# Altium project GPSGSMTruck.PrjPcb
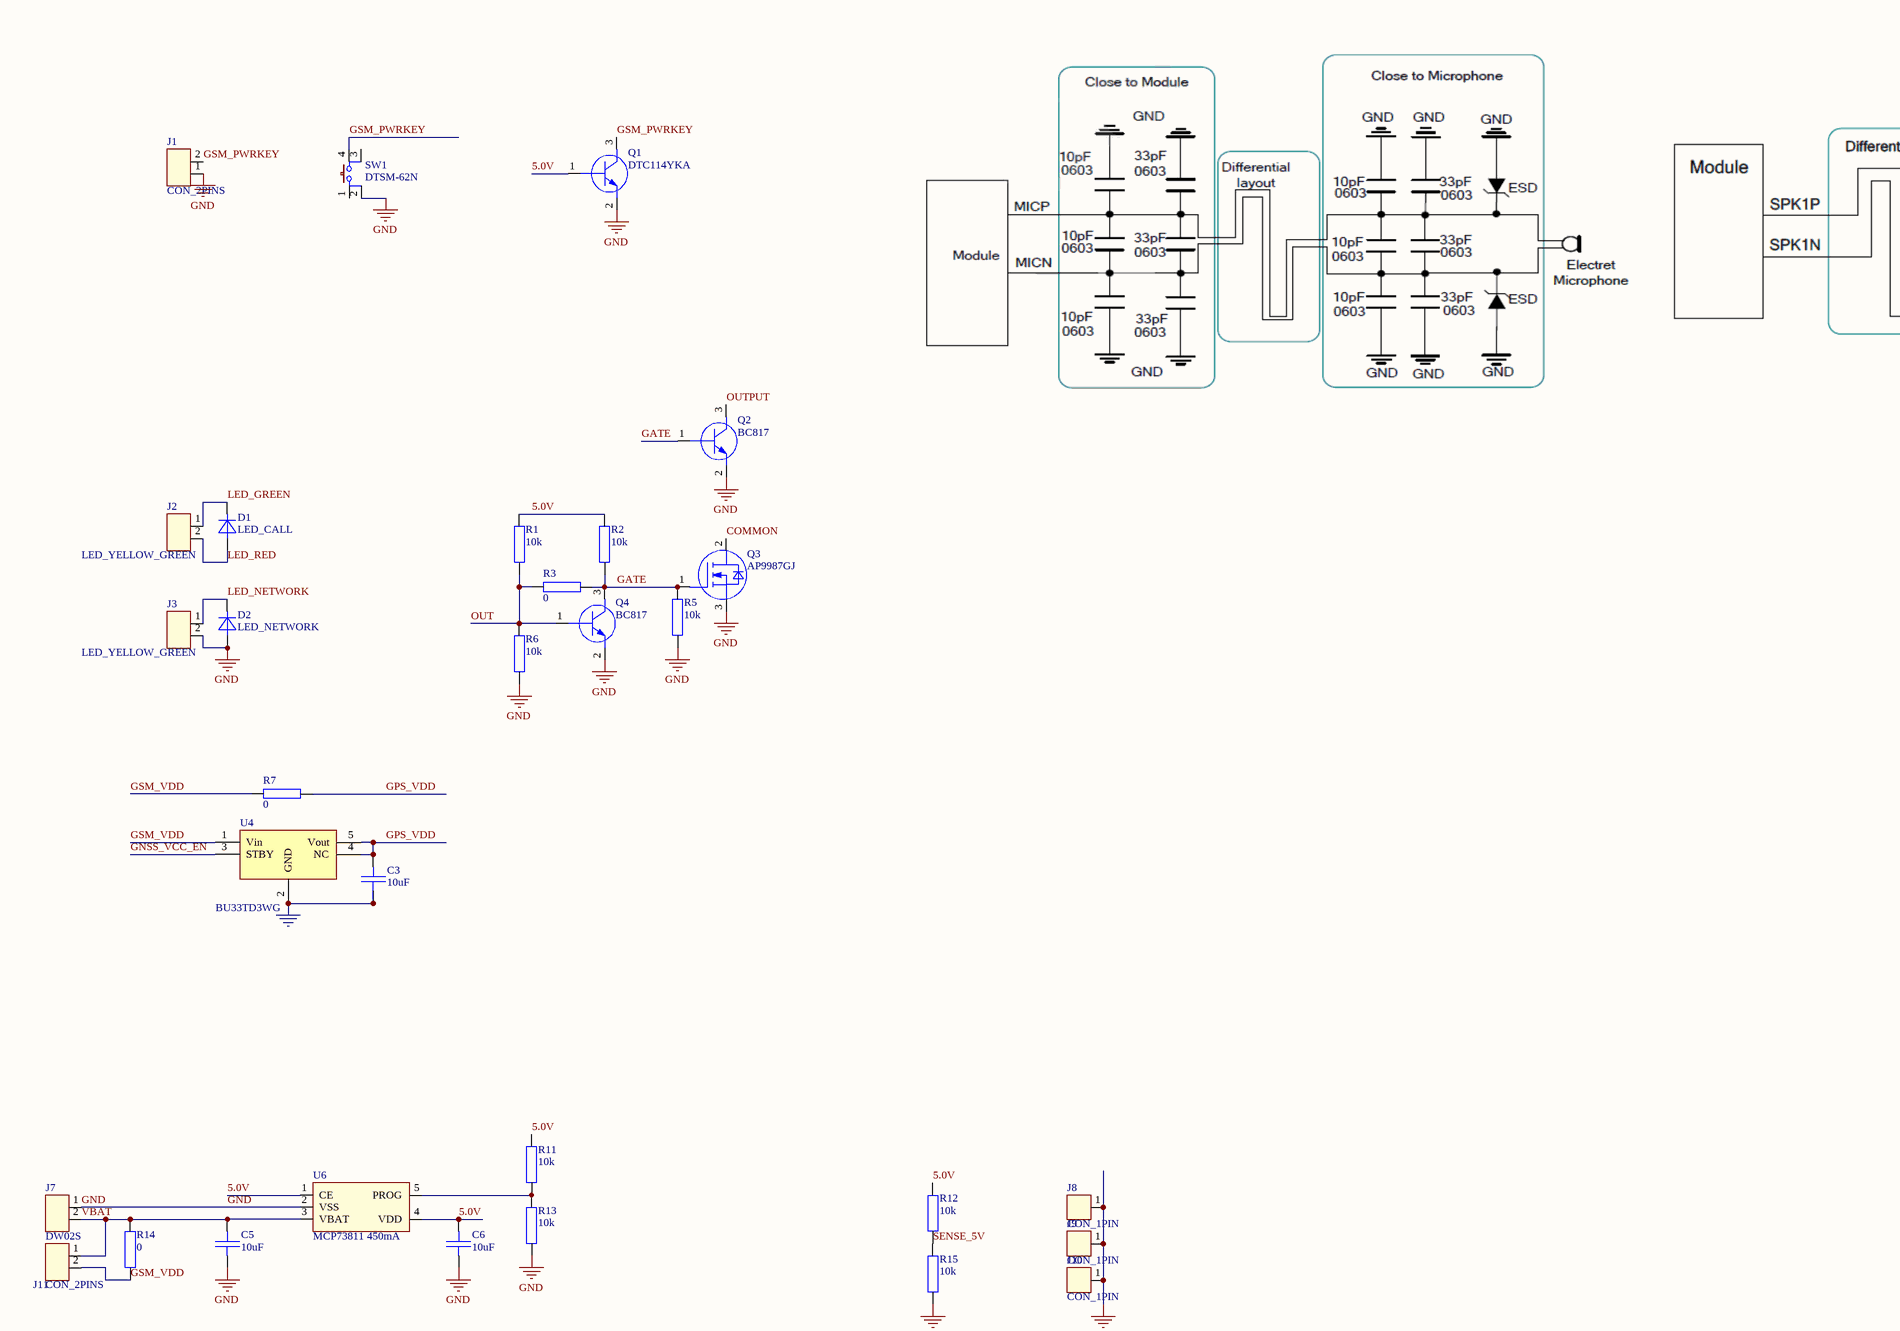
[diagram p0: GPSGSMTruck.SchDoc, top left]
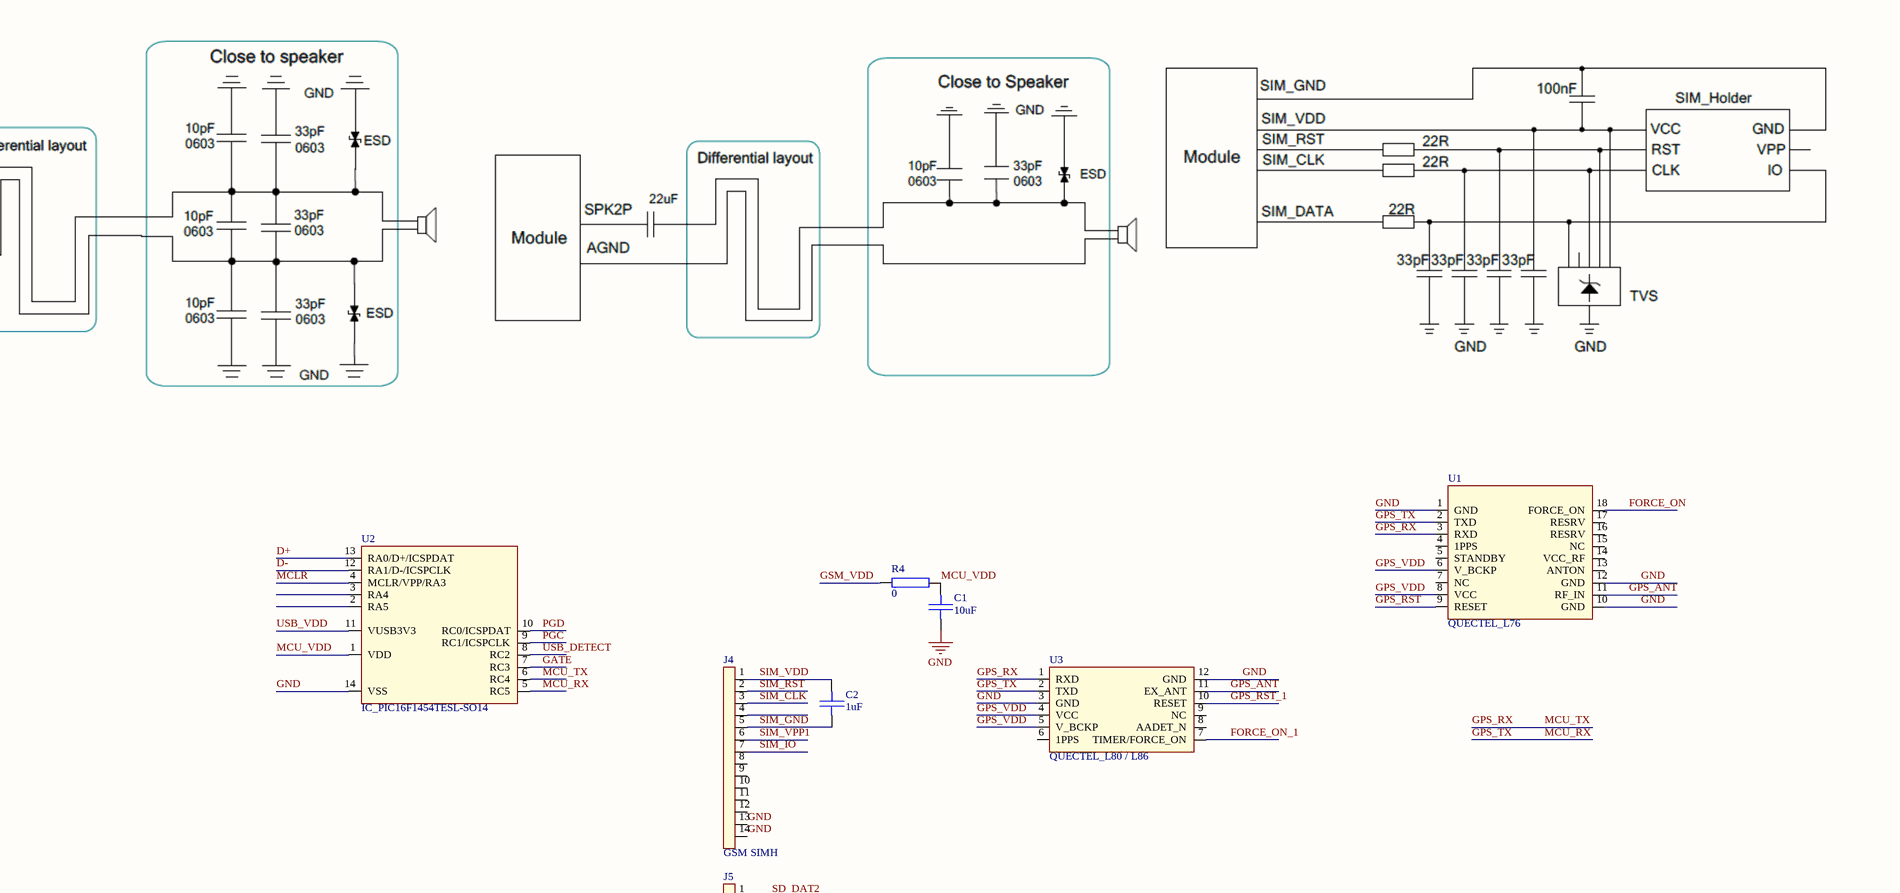
[diagram p1: GPSGSMTruck.SchDoc, top right]
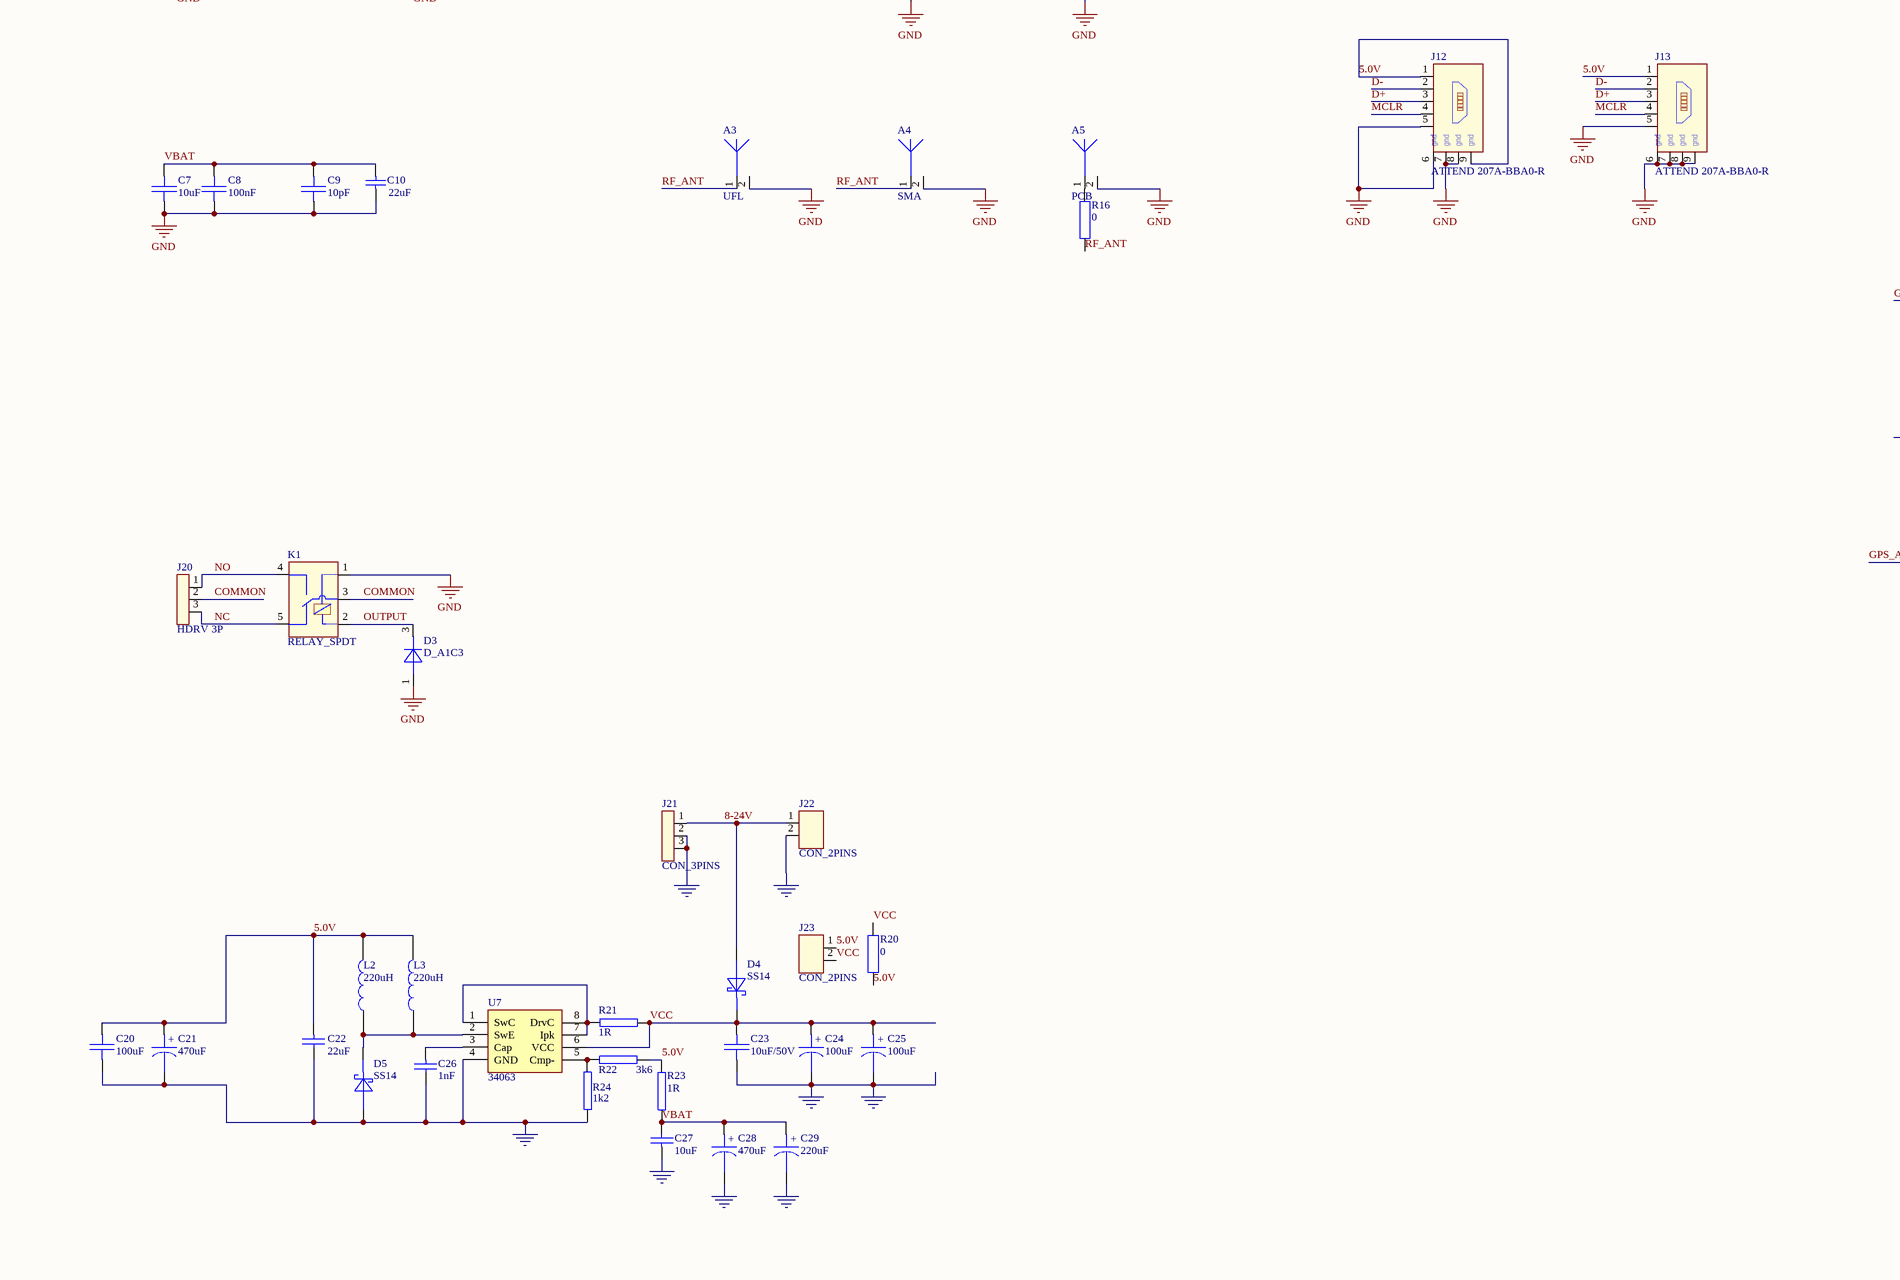
[diagram p2: GPSGSMTruck.SchDoc, bottom left]
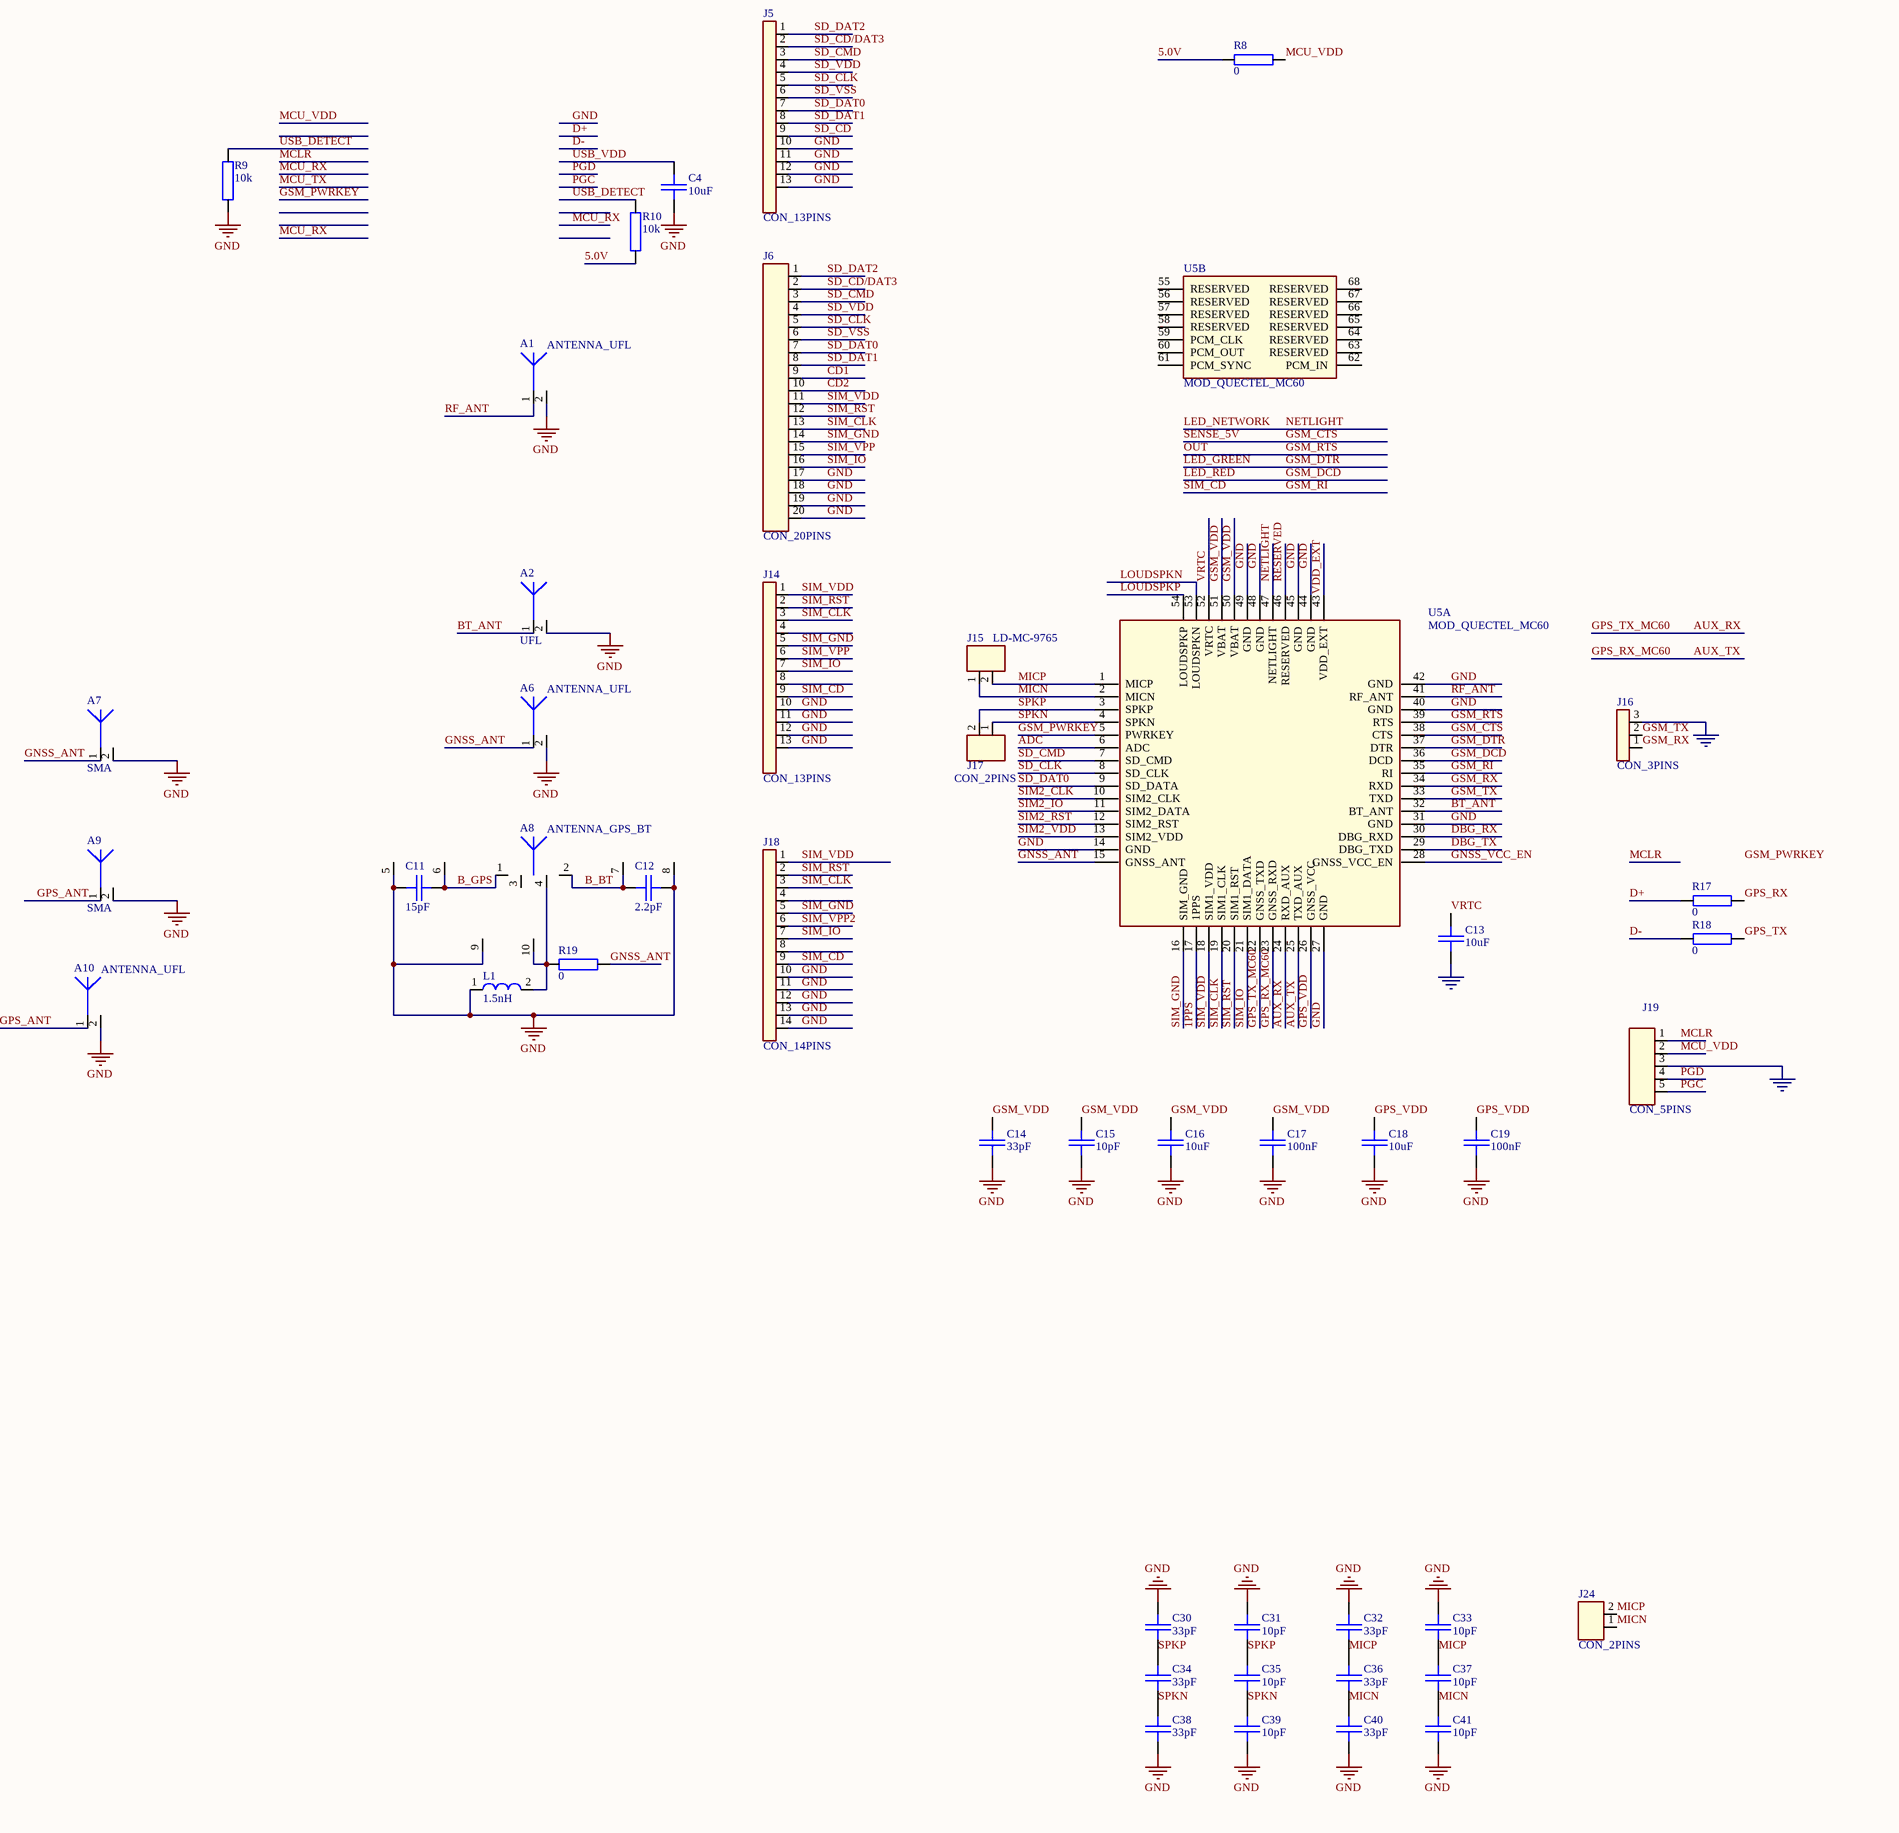
[diagram p3: GPSGSMTruck.SchDoc, bottom right]
1 sheet, 120 parts. Net scope: global (net labels, ports and power ports of the same name join across sheets).
Board file: GPSGSMTruck.PcbDoc

## Sheet GPSGSMTruck.SchDoc
size A1

### Parts
A1  ANTENNA_UFL  [SMD_CON_ANTENNA_UFL]
A2  UFL  [SMD_CON_ANTENNA_UFL]
A3  UFL  [SMD_CON_ANTENNA_UFL]
A4  SMA  [SMD_CON_ANTENNA_SMA_RIGHT_ANGLE]
A5  PCB  [SMD_CON_ANTENNA_GSM_PCB_1_INV]
A6  ANTENNA_UFL  [SMD_CON_ANTENNA_UFL]
A7  SMA  [SMD_CON_ANTENNA_SMA_RIGHT_ANGLE]
A8  ANTENNA_GPS_BT  [SMD_CHIP_ANTENNA_GPS_BT]
A9  SMA  [SMD_CON_ANTENNA_SMA_RIGHT_ANGLE]
A10  ANTENNA_UFL  [SMD_CON_ANTENNA_UFL]
C1  10uF  [SMD_0402_CAPC1005X90N]
C2  1uF  [SMD_0603_CAPC1608X95N]
C3  10uF  [SMD_0402_CAPC1005X90N]
C4  10uF  [SMD_0402_CAPC1005X90N]
C5  10uF  [SMD_0603_CAPC1608X95N]
C6  10uF  [SMD_0603_CAPC1608X95N]
C7  10uF  [SMD_0805_CAPC2012X95N]
C8  100nF  [SMD_0603_CAPC1608X95N]
C9  10pF  [SMD_0603_CAPC1608X95N]
C10  22uF  [SMD_1210_CAPC3225X279N]
C11  15pF  [SMD_0402_CAPC1005X90N - ANTENNA]
C12  2.2pF  [SMD_0201_CAPC0603X33N - ANTENNA]
C13  10uF  [SMD_0402_CAPC1005X90N]
C14  33pF  [SMD_0402_CAPC1005X90N]
C15  10pF  [SMD_0402_CAPC1005X90N]
C16  10uF  [SMD_0402_CAPC1005X90N]
C17  100nF  [SMD_0402_CAPC1005X90N]
C18  10uF  [SMD_0402_CAPC1005X90N]
C19  100nF  [SMD_0402_CAPC1005X90N]
C20  100uF  [SMD_1210_CAPC3225X279N]
C21  470uF  [PTH_CAPPR250-800X800]
C22  22uF  [SMD_0805_CAPC2012X145N]
C23  10uF/50V  [SMD_1210_CAPC3225X279N]
C24  100uF  [SMD_CAPAE660X550N]
C25  100uF  [PTH_CAPPR250-800X800]
C26  1nF  [SMD_0603_CAPC1608X95N]
C27  10uF  [SMD_0603_CAPC1608X95N]
C28  470uF  [PTH_CAPPR250-800X800]
C29  220uF  [SMD_CAPAE660X550N]
C30  33pF  [SMD_0603_CAPC1608X95N]
C31  10pF  [SMD_0603_CAPC1608X95N]
C32  33pF  [SMD_0603_CAPC1608X95N]
C33  10pF  [SMD_0603_CAPC1608X95N]
C34  33pF  [SMD_0603_CAPC1608X95N]
C35  10pF  [SMD_0603_CAPC1608X95N]
C36  33pF  [SMD_0603_CAPC1608X95N]
C37  10pF  [SMD_0603_CAPC1608X95N]
C38  33pF  [SMD_0603_CAPC1608X95N]
C39  10pF  [SMD_0603_CAPC1608X95N]
C40  33pF  [SMD_0603_CAPC1608X95N]
C41  10pF  [SMD_0603_CAPC1608X95N]
D1  LED_CALL  [SMD_0805_LED2012X100N]
D2  LED_NETWORK  [SMD_0805_LED2012X100N]
D3  D_A1C3  [SMD_SOT23_SOT95P240X120-3N]
D4  SS14  [SMD_DO214AC_SMA]
D5  SS14  [SMD_DO214AC_SMA]
J1  CON_2PINS  [PTH_HDRV02W64P254_1X02]
J2  LED_YELLOW_GREEN  [PTH_LED-KINGBRIGHT-L-934SGC]
J3  LED_YELLOW_GREEN  [PTH_LED-KINGBRIGHT-L-934SGC]
J4  GSM SIMH  [SMD_CON-ATTEND_SIM_115B-AAA0-R01]
J5  CON_13PINS  [NONE]
J6  CON_20PINS  [NONE]
J7  DW02S  [PTH_HDRV02W64P254_1X02_BATTERY]
J8  CON_1PIN  [PTH_MOUNT_HOLE]
J9  CON_1PIN  [PTH_MOUNT_HOLE]
J10  CON_1PIN  [PTH_MOUNT_HOLE]
J11  CON_2PINS  [PTH_HDRV02W64P254_1X02]
J12  ATTEND 207A-BBA0-R  [SMD_CON_MICRO_USB]
J13  ATTEND 207A-BBA0-R  [SMD_CON-CVILUX-CU04-SCM15B0]
J14  CON_13PINS  [SMD_CON-ATTEND_MICRO_SIM_115Q-BCA0]
J15  LD-MC-9765  [PTH_MIC_9.6MM_6MM]
J16  CON_3PINS  [PTH_HDRV03W64P254_1X03]
J17  CON_2PINS  [PTH_MIC_6MM_2.7MM_PITCH1.9]
J18  CON_14PINS  [NONE]
J19  CON_5PINS  [SIP5 - PGM]
J20  HDRV 3P  [PTH_HDRV03W11060P500_1X03]
J21  CON_3PINS  [PTH_DC-POWER-JACK_210-112]
J22  CON_2PINS  [PTH_HDRV02W11060P350_1X02]
J23  CON_2PINS  [PTH_HDRV02W64P254_1X02]
J24  CON_2PINS  [PTH_MIC_6MM_2.7MM_PITCH1.9]
K1  RELAY_SPDT  [PTH_REL_RAS]
L1  1.5nH  [SMD_0402_INDC1005X55N - ANTENNA]
L2  220uH  [SMD_INDM600500]
L3  220uH  [PTH_CAPPR250-800X800]
Q1  DTC114YKA  [SMD_SOT23_SOT95P240X120-3N]
Q2  BC817  [SMD_SOT23_SOT95P240X120-3N]
Q3  AP9987GJ  [PTH_TO220AB]
Q4  BC817  [SMD_SOT23_SOT95P240X120-3N]
R1  10k  [SMD_0603_RESC1608X55N]
R2  10k  [SMD_0603_RESC1608X55N]
R3  0  [SMD_0603_RESC1608X55N]
R4  0  [SMD_0402_RESC1005X37N]
R5  10k  [SMD_0603_RESC1608X55N]
R6  10k  [SMD_0603_RESC1608X55N]
R7  0  [SMD_0402_RESC1005X37N]
R8  0  [SMD_0402_RESC1005X37N]
R9  10k  [SMD_0402_RESC1005X37N]
R10  10k  [SMD_0402_RESC1005X37N]
R11  10k  [SMD_0603_RESC1608X55N]
R12  10k  [SMD_0603_RESC1608X55N]
R13  10k  [SMD_0603_RESC1608X55N]
R14  0  [SMD_0603_RESC1608X55N]
R15  10k  [SMD_0603_RESC1608X55N]
R16  0  [SMD_0402_RESC1005X37N]
R17  0  [SMD_0402_RESC1005X37N]
R18  0  [SMD_0402_RESC1005X37N]
R19  0  [SMD_0402_RESC1005X37N]
R20  0  [SMD_0603_RESC1608X55N]
R21  1R  [SMD_0805_RESC2012X60N]
R22  3k6  [SMD_0603_RESC1608X55N]
R23  1R  [SMD_0603_RESC1608X55N]
R24  1k2  [SMD_0603_RESC1608X55N]
SW1  DTSM-62N  [SMD_SW_TACT-64K_5]
U1  QUECTEL_L76  [SMD_MOD_L76_SOIC110P970X1010-18N]
U2  IC_PIC16F1454TESL-SO14  [SMD_SOIC127P600X175-14N]
U3  QUECTEL_L80 / L86  [SMD_MOD_L80_SOIC254P1600X1600-12N]
U4  BU33TD3WG  [SMD_SOT26_SOT95P285X140-5N - DLV]
U5  MOD_QUECTEL_MC60  [SMD_MOD_MC60_54_PIN]  (parts A,B of 2)
U6  MCP73811 450mA  [SMD_SOT26_SOT95P285X140-5N - DLV]
U7  34063  [SMD_SOIC127P600X175-8N]

### Nets
GND: A1.2 A2.2 A3.2 A4.2 A5.2 A6.2 A7.2 A8.5 A8.8 A8.9 A9.2 A10.2 C1.2 C3.2 C4.2 C5.2 C6.2 C7.2 C8.2 C9.2 C10.2 C11.1 C12.2 C13.2 C14.2 C15.2 C16.2 C17.2 C18.2 C19.2 C20.1 C21.2 C22.2 C23.1 C24.2 C25.2 C26.2 C27.1 C28.2 C29.2 C30.1 C31.1 C32.1 C33.1 C38.2 C39.2 C40.2 C41.2 D2.2(A) D3.1(A) D5.2(A) J1.1 J3.2 J4.13 J4.14 J5.10 J5.11 J5.12 J5.13 J6.17 J6.18 J6.19 J6.20 J7.1 J8.1 J9.1 J10.1 J12.5 J12.6 J12.7 J12.8 J13.5 J13.6 J13.7 J13.8 J13.9 J14.10 J14.11 J14.12 J14.13 J16.3 J18.10 J18.11 J18.12 J18.13 J18.14 J19.3 J21.2 J21.3 J22.2 K1.1 L1.1 Q1.2(E) Q2.2(E) Q3.3(S) Q4.2(E) R5.2 R6.2 R9.1 R13.2 R15.2 R24.2 SW1.2 U1.1(GND) U1.10(GND) U1.12(GND) U2.14(VSS) U3.3(GND) U3.12(GND) U4.2(GND) U5.14(GND) U5.27(GND) U5.31(GND) U5.40(GND) U5.42(GND) U5.44(GND) U5.45(GND) U5.48(GND) U5.49(GND) U6.2(VSS) U7.4(GND)
1PPS: U5.17(1PPS)
5.0V: C6.1 C20.2 C21.1 C22.1 J12.1 J12.9 J13.1 J23.1 L2.2 L3.2 Q1.1(B) R1.1 R2.1 R8.1 R10.2 R11.1 R12.1 R20.2 R22.1 R23.2 U6.1(CE) U6.4(VDD)
8-24V: D4.2(A) J21.1 J22.1
ADC: U5.6(ADC)
AUX_RX: U5.22(GNSS_TXD) U5.24(RXD_AUX)  [also labelled GPS_TX_MC60]
AUX_TX: U5.23(GNSS_RXD) U5.25(TXD_AUX)  [also labelled GPS_RX_MC60]
B_BT: A8.2 A8.7 C12.1
B_GPS: A8.1 A8.6 C11.2
BT_ANT: A2.1 U5.32(BT_ANT)
CD1: J6.9
CD2: J6.10
COMMON: J20.2 K1.3 Q3.2(D)
D+: J12.3 J13.3 R17.1 U2.13(RA0/D+/ICSPDAT)
D-: J12.2 J13.2 R18.1 U2.12(RA1/D-/ICSPCLK)
DBG_RX: U5.30(DBG_RXD)
DBG_TX: U5.29(DBG_TXD)
FORCE_ON: U1.18(FORCE_ON)
FORCE_ON_1: U3.7(TIMER/FORCE_ON)
GATE: Q2.1(B) Q3.1(G) Q4.3(C) R2.2 R3.2 R5.1 U2.7(RC3)
GNSS_ANT: A6.1 A7.1 R19.1 U5.15(GNSS_ANT)
GNSS_VCC_EN: U4.3(STBY) U5.28(GNSS_VCC_EN)
GPS_ANT: A9.1 A10.1 U1.11(RF_IN) U3.11(EX_ANT)
GPS_RST: U1.9(RESET)
GPS_RST_1: U3.10(RESET)
GPS_RX: R17.2 U1.3(RXD) U2.6(RC4) U3.1(RXD)  [also labelled MCU_TX]
GPS_TX: R18.2 U1.2(TXD) U2.5(RC5) U3.2(TXD)  [also labelled MCU_RX]
GPS_VDD: C3.1 C18.1 C19.1 R7.2 U1.6(V_BCKP) U1.8(VCC) U3.4(VCC) U3.5(V_BCKP) U4.4(NC) U4.5(Vout) U5.26(GNSS_VCC)
GSM_CTS: R12.2 R15.1 U5.38(CTS)  [also labelled SENSE_5V]
GSM_DCD: D1.2(A) J2.2 U5.36(DCD)  [also labelled LED_RED]
GSM_DTR: D1.1(C) J2.1 U5.37(DTR)  [also labelled LED_GREEN]
GSM_PWRKEY: J1.2 Q1.3(C) SW1.4 U5.5(PWRKEY)
GSM_RI: J14.9 J18.9 U5.35(RI)  [also labelled SIM_CD]
GSM_RTS: Q4.1(B) R1.2 R3.1 R6.1 U5.39(RTS)  [also labelled OUT]
GSM_RX: J16.1 U5.34(RXD)
GSM_TX: J16.2 U5.33(TXD)
GSM_VDD: C14.1 C15.1 C16.1 C17.1 J11.2 R4.1 R7.1 R14.1 U4.1(Vin) U5.50(VBAT) U5.51(VBAT)
LED_NETWORK: D2.1(C) J3.1 U5.47(NETLIGHT)  [also labelled NETLIGHT]
LOUDSPKN: U5.53(LOUDSPKN)
LOUDSPKP: U5.54(LOUDSPKP)
MCLR: J12.4 J13.4 J19.1 U2.4(MCLR/VPP/RA3)
MCU_VDD: C1.1 J19.2 R4.2 R8.2 U2.1(VDD)
MICN: C36.2 C37.2 C40.1 C41.1 J15.1 J24.1 U5.2(MICN)
MICP: C32.2 C33.2 C36.1 C37.1 J15.2 J24.2 U5.1(MICP)
NC: J20.3 K1.5
NO: J20.1 K1.4
OUTPUT: D3.3(C) K1.2 Q2.3(C)
PGC: J19.5 U2.9(RC1/ICSPCLK)
PGD: J19.4 U2.10(RC0/ICSPDAT)
RESERVED: U5.46(RESERVED)
RF_ANT: A1.1 A3.1 A4.1 R16.2 U5.41(RF_ANT)
SD_CD: J5.9
SD_CD/DAT3: J5.2 J6.2
SD_CLK: J5.5 J6.5 U5.8(SD_CLK)
SD_CMD: J5.3 J6.3 U5.7(SD_CMD)
SD_DAT0: J5.7 J6.7 U5.9(SD_DATA)
SD_DAT1: J5.8 J6.8
SD_DAT2: J5.1 J6.1
SD_VDD: J5.4 J6.4
SD_VSS: J5.6 J6.6
SIM2_CLK: U5.10(SIM2_CLK)
SIM2_IO: U5.11(SIM2_DATA)
SIM2_RST: U5.12(SIM2_RST)
SIM2_VDD: U5.13(SIM2_VDD)
SIM_CLK: J4.3 J6.13 J14.3 J18.3 U5.19(SIM1_CLK)
SIM_GND: C2.2 J4.5 J6.14 J14.5 J18.5 U5.16(SIM_GND)
SIM_IO: J4.7 J6.16 J14.7 J18.7 U5.21(SIM1_DATA)
SIM_RST: J4.2 J6.12 J14.2 J18.2 U5.20(SIM1_RST)
SIM_VDD: C2.1 J4.1 J6.11 J14.1 J18.1 U5.18(SIM1_VDD)
SIM_VPP: J6.15 J14.6
SIM_VPP1: J4.6
SIM_VPP2: J18.6
SPKN: C34.2 C35.2 C38.1 C39.1 J17.1 U5.4(SPKN)
SPKP: C30.2 C31.2 C34.1 C35.1 J17.2 U5.3(SPKP)
USB_DETECT: R9.2 R10.1 U2.8(RC2)
USB_VDD: C4.1 U2.11(VUSB3V3)
VBAT: C5.1 C7.1 C8.1 C9.1 C10.1 C27.2 C28.1 C29.1 J7.2 J11.1 R14.2 R23.1 U6.3(VBAT)
VCC: C23.2 C24.1 C25.1 D4.1(C) J23.2 R20.1 R21.2 U7.6(VCC)
VDD_EXT: U5.43(VDD_EXT)
VRTC: C13.1 U5.52(VRTC)
NetA5_1: A5.1 R16.1
NetA8_4: A8.4 A8.10 L1.2 R19.2
NetC26_1: C26.1 U7.3(Cap)
NetD5_1: D5.1(C) L2.1 L3.1 U7.2(SwE)
NetR11_2: R11.2 R13.1 U6.5(PROG)
NetR21_1: R21.1 U7.1(SwC) U7.7(Ipk) U7.8(DrvC)
NetR22_2: R22.2 R24.1 U7.5(Cmp-)

Not connected (* = marked no-connect by the designer): A8 3; J4 4 8 9 10 11 12; J14 4 8; J18 4 8; SW1 1 3; U1 4(1PPS) 5(STANDBY) 7(NC) 13(ANTON) 14(VCC_RF) 15(NC) 16(RESRV) 17(RESRV); U2 2(RA5) 3(RA4); U3 6(1PPS) 8(AADET_N) 9(NC); U5 55(RESERVED) 56(RESERVED) 57(RESERVED) 58(RESERVED) 59(PCM_CLK) 60(PCM_OUT) 61(PCM_SYNC) 62(PCM_IN) 63(RESERVED) 64(RESERVED) 65(RESERVED) 66(RESERVED) 67(RESERVED) 68(RESERVED)

### Notes on the sheet
- Labels drawn without touching a wire or pin: GSM_PWRKEY
- (in symbol CAPACITOR POL) +
- (in symbol CON_USB_MINI) gnd

### Library data of the parts
A1-A7 A9 A10 = ANTENNA_2: NOTE: <NOTE>
A8 = ANTENNA_GPS_BT: NOTE: <NOTE>
C1-C9 C11-C20 C23 C30-C41 = C: NOTE: <NOTE>
C10 = Cap Semi: CL32A227MQVNNNE 220UF 6.3V 20% X5R 1210; Published: 8-Jun-2000; LatestRevisionDate: 29-May-2009; LatestRevisionNote: IPC-7351 Footprint Added.; PackageReference: C1206; Publisher: Altium Limited; PackageDescription: Chip Capacitor; Value: 22uF
C21 C24 C25 C28 C29 = CAPACITOR POL: Capacitor
C22 C26 C27 = CAP: Capacitor
D1 D2 = D: NOTE: <NOTE>
D3 = D_A1C3: 1N4148; NOTE: <NOTE>
D4 D5 = D_STKY: NOTE: <NOTE>
J1-J3 J7 J11 J15 J17 J22-J24 = CON_2PINS: NOTE: <NOTE>
J4 = CON_14PINS
J8-J10 = CON_1PIN: NOTE: <NOTE>
J12 J13 = CON_USB_MINI: NOTE: <NOTE>
J19 = CON_5PINS: NOTE: <NOTE>
J20 = CON_3PINS
L1 = L
L2 = INDUCTOR1: FPI0504 DA54
L3 = INDUCTOR1
Q1 Q2 Q4 = BJT_NPN_B1E2C3: NOTE: <NOTE>
Q3 = MOS_N_D1_G1D2S3: NOTE: <NOTE>
R1-R20 = R: NOTE: <NOTE>; R_BDS: R
R21-R24 = RES2
SW1 = BUTTON_1
U1 = MOD_QUECTEL_L76
U3 = MOD_QUECTEL_L80_L86
U4 = IC_BU33TD3WG
U6 = IC_MCP73812: MCP73812; DB_PART_NUMBER: PSU000000127; DB_PART_TYPE: Linear Voltage Regulator; DB_MANUFACTURER_PART: ROHM        BD33KA5WF-E2; DB_T_RANGE: -40 to 105; DB_VOLTAGE: 3.3V; DB_CURRENT: 500mA; DB_PACKAGE: SOIC-8; DB_DESCRIPTION: IC BD33KA5WF-E2 SOIC-8; DB_PCB_DEVICE: SMD_SOIC127P620X160-8N; DB_CERTIFIED: ISHIDDEN=T; DB_APPROVED_BY: VSN; DB_APPROVED_ON: 07.5.2014 г. 13:18:28; DB_STATUS: NEW; DB_DATASHEET: http://john.epiqdesign.com/projects/CIS_Datasheets/IC_bdxxka5wf-e-209388.pdf?rev=1408&sc=0
U7 = 34063: DC/DC converter
U5 = MOD_QUECTEL_MC60: PCB DECAL: *

## Assembly variants
Production: not fitted A3 C9 C15 J2 J3 J20 Q2 Q3 R2 R3 R4 R6 R7 R8 R10 R12 R13 SW4
Production_Last: not fitted A1 A3 C9 C15 C39 D2 D4 D6 J1 J2 J3 J4 J5 J11 J12 J14 J15 J16 J17 J19 J20 J21 J22 J23 J24 J25 J26 J27 Q2 Q3 R2 R3 R4 R7 R8 R10 R11 R12 R13 R14 R17 SW1 SW4 U1
Production_24V: not fitted A1 A3 C9 C15 C36 C37 C39 D4 D6 J1 J2 J3 J4 J5 J9 J11 J12 J14 J15 J16 J17 J19 J20 J21 J22 J23 J24 J25 J26 J27 Q2 Q3 R2 R3 R4 R6 R7 R8 R10 R11 R12 R13 R14 R17 SW1 SW4